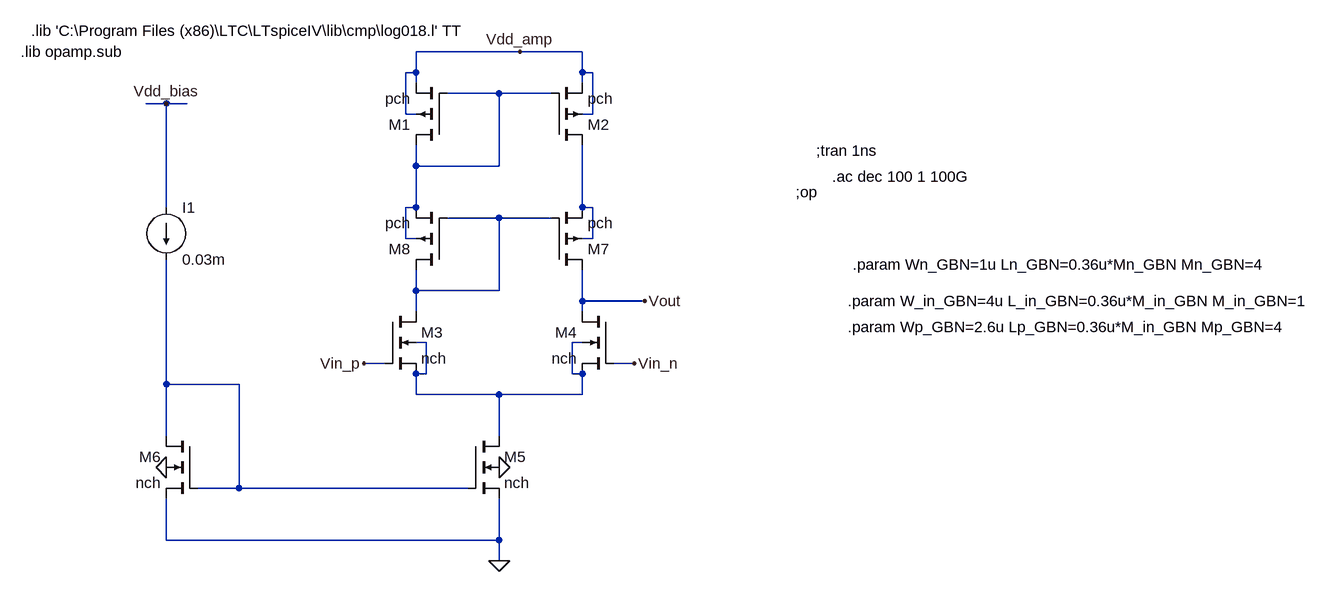
[diagram p0: schematic Diffn-GB.asc]
Diffn-GB.asc, the LTspice schematic file:
Version 4
SHEET 1 2296 852
WIRE 0 -352 -160 -352
WIRE 96 -352 0 -352
WIRE -160 -320 -160 -352
WIRE -160 -320 -176 -320
WIRE 96 -320 96 -352
WIRE 112 -320 96 -320
WIRE -160 -304 -160 -320
WIRE 96 -304 96 -320
WIRE -32 -288 -112 -288
WIRE -16 -288 -32 -288
WIRE 48 -288 -16 -288
WIRE -544 -272 -576 -272
WIRE -512 -272 -544 -272
WIRE -176 -256 -176 -320
WIRE -160 -256 -176 -256
WIRE 112 -256 112 -320
WIRE 112 -256 96 -256
WIRE -160 -176 -160 -208
WIRE -32 -176 -32 -288
WIRE -32 -176 -160 -176
WIRE -544 -112 -544 -272
WIRE -160 -112 -160 -176
WIRE -160 -112 -176 -112
WIRE 96 -112 96 -208
WIRE 112 -112 96 -112
WIRE -32 -96 -112 -96
WIRE -16 -96 -32 -96
WIRE 48 -96 -16 -96
WIRE -176 -64 -176 -112
WIRE -160 -64 -176 -64
WIRE 112 -64 112 -112
WIRE 112 -64 96 -64
WIRE -160 16 -160 -16
WIRE -32 16 -32 -96
WIRE -32 16 -160 16
WIRE 96 32 96 -16
WIRE 160 32 96 32
WIRE 192 32 160 32
WIRE -160 48 -160 16
WIRE 96 48 96 32
WIRE -144 96 -160 96
WIRE 96 96 80 96
WIRE -208 128 -240 128
WIRE 176 128 144 128
WIRE -144 144 -144 96
WIRE -144 144 -160 144
WIRE 80 144 80 96
WIRE 96 144 80 144
WIRE -544 160 -544 -32
WIRE -432 160 -544 160
WIRE -160 176 -160 144
WIRE -32 176 -160 176
WIRE 96 176 96 144
WIRE 96 176 -32 176
WIRE -544 240 -544 160
WIRE -32 240 -32 176
WIRE -432 320 -432 160
WIRE -432 320 -496 320
WIRE -320 320 -432 320
WIRE -80 320 -320 320
WIRE -544 400 -544 336
WIRE -32 400 -32 336
WIRE -32 400 -544 400
WIRE -32 432 -32 400
FLAG -32 432 0
FLAG -32 288 0
FLAG -544 288 0
FLAG 0 -352 Vdd_amp
FLAG -544 -272 Vdd_bias
FLAG -240 128 Vin_p
FLAG 176 128 Vin_n
FLAG 192 32 Vout
DATAFLAG 16 224 "round(Id(M23)*100000000)/100000000"
DATAFLAG -320 320 ""
DATAFLAG 144 -176 "round(-Id(x6:x5:M2)*100000000)/100000000"
DATAFLAG -96 224 "round(Id(x6:x5:M5)*100000000)/100000000"
DATAFLAG -224 -192 "round(-Id(x6:x5:M1)*100000000)/100000000"
DATAFLAG -16 -288 ""
DATAFLAG -32 176 ""
DATAFLAG -224 0 "round(-Id(x6:x5:M1)*100000000)/100000000"
DATAFLAG -224 0 "round(-Id(x6:x5:M1)*100000000)/100000000"
DATAFLAG -16 -96 ""
DATAFLAG 160 32 ""
SYMBOL pmos4 48 -208 M180
SYMATTR InstName M2
SYMATTR Value pch
SYMATTR Value2 l={Lp_GBN} w={Wp_GBN}
SYMBOL nmos4 144 48 M0
SYMATTR InstName M4
SYMATTR Value nch
SYMATTR Value2 l={L_in_GBN} w={W_in_GBN} m={Mn_GBN}
SYMBOL nmos4 -80 240 R0
SYMATTR InstName M5
SYMATTR Value nch
SYMATTR Value2 l={Ln_GBN} w={Wn_GBN} m={Mn_GBN}
SYMBOL current -544 -112 R0
WINDOW 123 0 0 Left 2
WINDOW 39 0 0 Left 2
SYMATTR InstName I1
SYMATTR Value 0.03m
SYMBOL pmos4 -112 -208 R180
SYMATTR InstName M1
SYMATTR Value pch
SYMATTR Value2 l={Lp_GBN} w={Wp_GBN}
SYMBOL nmos4 -208 48 R0
SYMATTR InstName M3
SYMATTR Value nch
SYMATTR Value2 l={L_in_GBN} w={W_in_GBN} m={Mn_GBN}
SYMBOL nmos4 -496 240 M0
SYMATTR InstName M6
SYMATTR Value nch
SYMATTR Value2 l={Ln_GBN} w={Wn_GBN} m={Mn_GBN}
SYMBOL pmos4 48 -16 M180
SYMATTR InstName M7
SYMATTR Value pch
SYMATTR Value2 l={Lp_GBN} w={Wp_GBN}
SYMBOL pmos4 -112 -16 R180
SYMATTR InstName M8
SYMATTR Value pch
SYMATTR Value2 l={Lp_GBN} w={Wp_GBN}
TEXT -752 -384 Left 2 !.lib 'C:\\Program Files (x86)\\LTC\\LTspiceIV\\lib\\cmp\\log018.l' TT
TEXT -768 -352 Left 2 !.lib opamp.sub
TEXT 512 -24 Left 2 !.param Wn_GBN=1u Ln_GBN=0.36u*Mn_GBN Mn_GBN=4
TEXT 504 72 Left 2 !.param Wp_GBN=2.6u Lp_GBN=0.36u*M_in_GBN Mp_GBN=4
TEXT 504 32 Left 2 !.param W_in_GBN=4u L_in_GBN=0.36u*M_in_GBN M_in_GBN=1
TEXT 480 -160 Left 2 !.ac dec 100 1 100G
TEXT 424 -136 Left 2 !;op
TEXT 456 -200 Left 2 !;tran 1ns

The netlist it stands for:
* Diffn-GB.asc
M2 N002 N001 Vdd_amp Vdd_amp pch l={Lp_GBN} w={Wp_GBN}
M4 Vout Vin_n N004 N004 nch l={L_in_GBN} w={W_in_GBN} m={Mn_GBN}
M5 N004 N005 0 0 nch l={Ln_GBN} w={Wn_GBN} m={Mn_GBN}
I1 Vdd_bias N005 0.03m
M1 N001 N001 Vdd_amp Vdd_amp pch l={Lp_GBN} w={Wp_GBN}
M3 N003 Vin_p N004 N004 nch l={L_in_GBN} w={W_in_GBN} m={Mn_GBN}
M6 N005 N005 0 0 nch l={Ln_GBN} w={Wn_GBN} m={Mn_GBN}
M7 Vout N003 N002 N002 pch l={Lp_GBN} w={Wp_GBN}
M8 N003 N003 N001 N001 pch l={Lp_GBN} w={Wp_GBN}
.model NMOS NMOS
.model PMOS PMOS
.lib standard.mos
.lib 'C:\Program Files (x86)\LTC\LTspiceIV\lib\cmp\log018.l' TT
.lib opamp.sub
.param Wn_GBN=1u Ln_GBN=0.36u*Mn_GBN Mn_GBN=4
.param Wp_GBN=2.6u Lp_GBN=0.36u*M_in_GBN Mp_GBN=4
.param W_in_GBN=4u L_in_GBN=0.36u*M_in_GBN M_in_GBN=1
.ac dec 100 1 100G
;op
;tran 1ns
.backanno
.end